# Altium schematic sheet 4_Arduino.SchDoc
size A
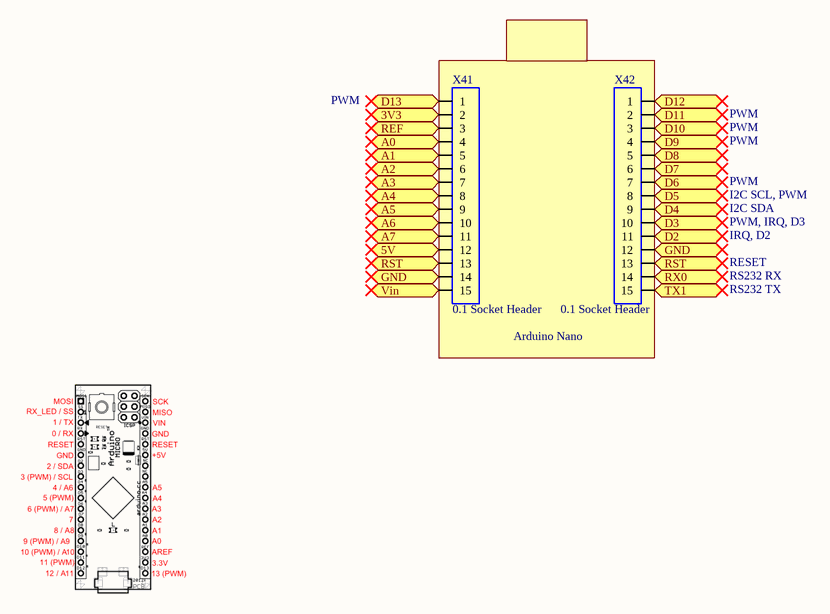
[diagram p0: 4_Arduino.SchDoc]

## Parts
X41  0.1 Socket Header  [HDR-0.1-15X1]
X42  0.1 Socket Header  [HDR-0.1-15X1]

## Blocks framed on the sheet
Arduino Nano: X41 X42

## Ports
3V3, 5V, A0, A1, A2, A3, A4, A5, A6, A7, D2, D3, D4, D5, D6, D7, D8, D9, D10, D11, D12, D13, GND, REF, RST, RX0, TX1, Vin

## Nets
3V3: X41.2 ; port 3V3
5V: X41.12 ; port 5V
A0: X41.4 ; port A0
A1: X41.5 ; port A1
A2: X41.6 ; port A2
A3: X41.7 ; port A3
A4: X41.8 ; port A4
A5: X41.9 ; port A5
A6: X41.10 ; port A6
A7: X41.11 ; port A7
D2: X42.11 ; port D2
D3: X42.10 ; port D3
D4: X42.9 ; port D4
D5: X42.8 ; port D5
D6: X42.7 ; port D6
D7: X42.6 ; port D7
D8: X42.5 ; port D8
D9: X42.4 ; port D9
D10: X42.3 ; port D10
D11: X42.2 ; port D11
D12: X42.1 ; port D12
D13: X41.1 ; port D13
GND: X41.14 X42.12 ; port GND
REF: X41.3 ; port REF
RST: X41.13 X42.13 ; port RST
RX0: X42.14 ; port RX0
TX1: X42.15 ; port TX1
Vin: X41.15 ; port Vin

## Notes on the sheet
- PWM
- I2C SCL, PWM
- RS232 RX
- RESET
- IRQ, D2
- PWM, IRQ, D3
- I2C SDA
- RS232 TX

## Library data of the parts
X41 X42 = 9896: Connector 15 pin general; Part Field 1: CONN15 15X1 2.54mm Socket Header, Tin, RoHS; Manufacturer: Sullins; PartNumber: PPTC151LFBN-RC; IPN: 9896; Characteristics: I=3A -40..105C 250V; Lead_Process_Compatible: Yes; SubmittedBy: zmze; DeviceRank: 2; Part Field 2: Sullins PPTC151LFBN-RC; ComponentLink1Description: Sullins_PPTC151LFBN-RC_78_P(N)PxCxxxLFBN-RC,_10492-H.pdf; ComponentLink2Description: Compliant; ComponentLink1URL: http://ecad.vsl.com.au/apps/BomGen/Data/rel/datasheets/Sullins/Sullins_PPTC151LFBN-RC_78_P(N)PxCxxxLFBN-RC,_10492-H.pdf; Altium_Comment_Old: CONN15 15X1 2.54mm Socket Header, Tin, RoHS; Altium_Comment: 0.1 Socket Header; Symbol: CONN15; LastChanged: 09/08/16 08:13:32; Supplier1: Digikey; Supplier1_PartNumber: S7013-ND; IPN_Search: 9896; OrderNumber: PPTC151LFBN-RC; PartType: PCB